# EAGLE design dlp.vco..v1.1.4.main (EAGLE 7.2.0)
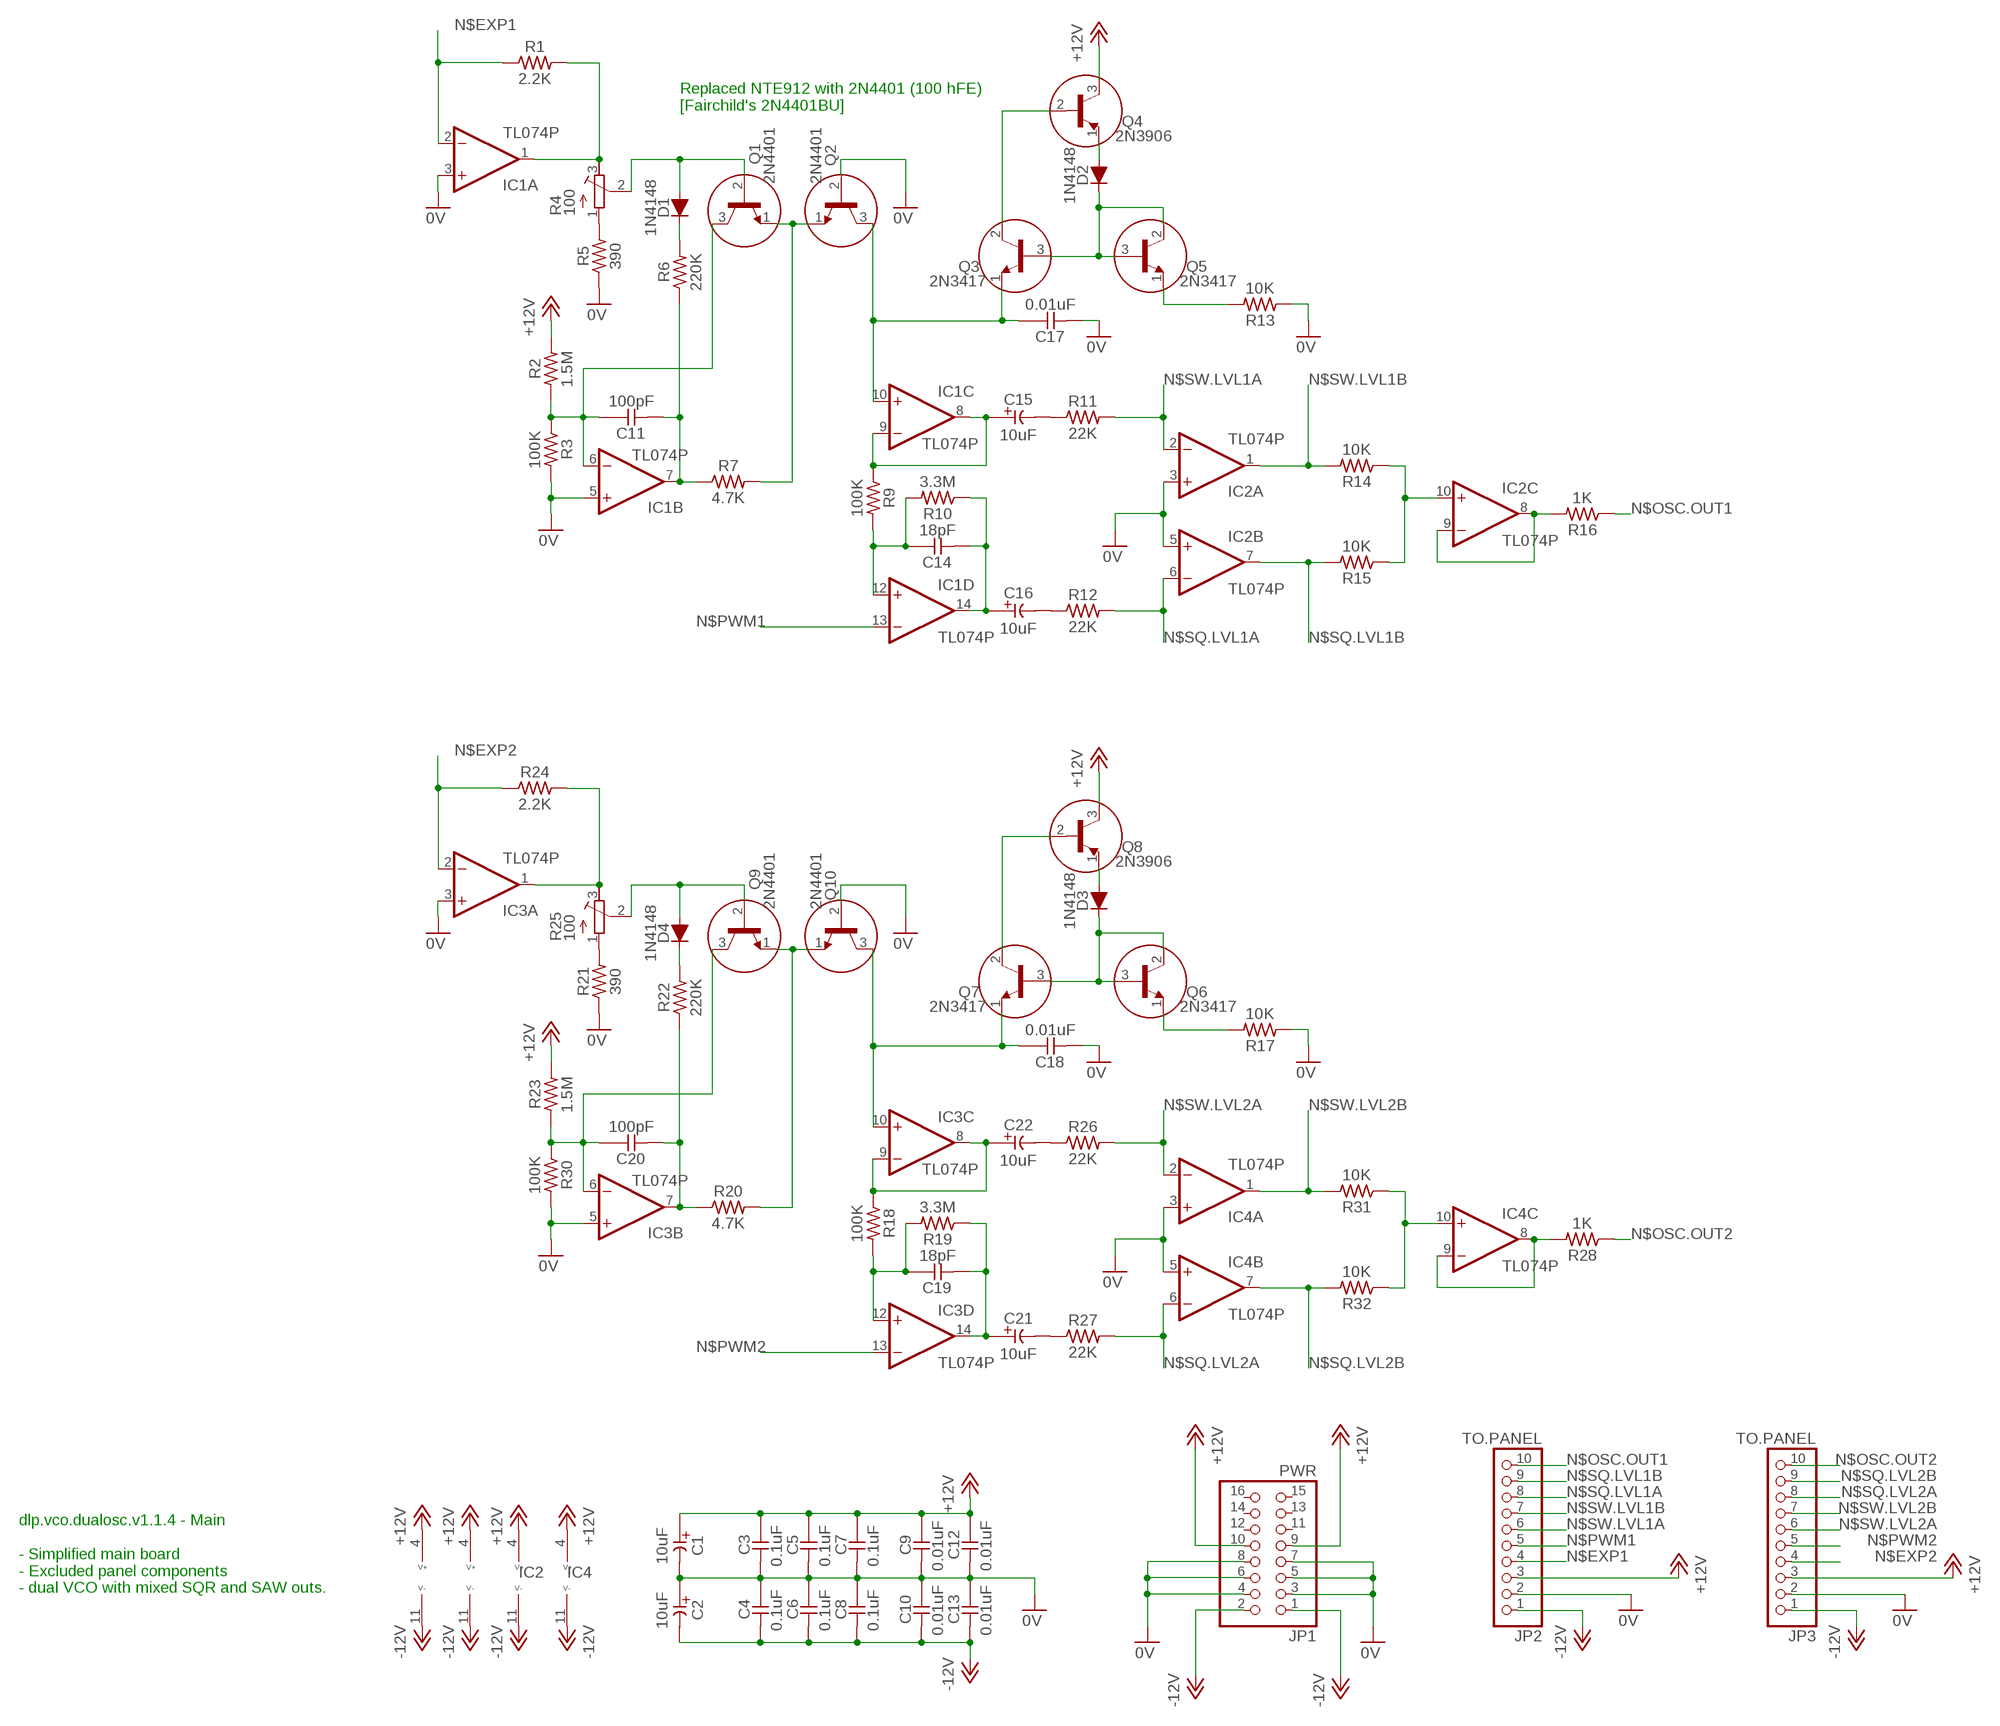
[diagram p0: schematic, sheet 1]

## Parts
C1  10uF  CE-USE2-5  [E2-5]
C2  10uF  CE-USE2-5  [E2-5]
C3  0.1uF  CC-US025-024X044  [C025-024X044]
C4  0.1uF  CC-US025-024X044  [C025-024X044]
C5  0.1uF  CC-US025-024X044  [C025-024X044]
C6  0.1uF  CC-US025-024X044  [C025-024X044]
C7  0.1uF  CC-US025-024X044  [C025-024X044]
C8  0.1uF  CC-US025-024X044  [C025-024X044]
C9  0.01uF  CC-US025-024X044  [C025-024X044]
C10  0.01uF  CC-US025-024X044  [C025-024X044]
C11  100pF  CC-US025-024X044  [C025-024X044]
C12  0.01uF  CC-US025-024X044  [C025-024X044]
C13  0.01uF  CC-US025-024X044  [C025-024X044]
C14  18pF  CC-US025-024X044  [C025-024X044]
C15  10uF  CE-USE2-5  [E2-5]
C16  10uF  CE-USE2-5  [E2-5]
C17  0.01uF  CC-US025-024X044  [C025-024X044]
C18  0.01uF  CC-US025-024X044  [C025-024X044]
C19  18pF  CC-US025-024X044  [C025-024X044]
C20  100pF  CC-US025-024X044  [C025-024X044]
C21  10uF  CE-USE2-5  [E2-5]
C22  10uF  CE-USE2-5  [E2-5]
D1  1N4148  [DO35-7]
D2  1N4148  [DO35-7]
D3  1N4148  [DO35-7]
D4  1N4148  [DO35-7]
IC1  TL074P  [DIL14]
IC2  TL074P  [DIL14]
IC3  TL074P  [DIL14]
IC4  TL074P  [DIL14]
JP1  PWR  PINHD-2X8  [2X08]
JP2  TO.PANEL  PINHD-1X10  [1X10]
JP3  TO.PANEL  PINHD-1X10  [1X10]
Q1  2N4401  [TO92]
Q2  2N4401  [TO92]
Q3  2N3417  [TO92]
Q4  2N3906  [TO92]
Q5  2N3417  [TO92]
Q6  2N3417  [TO92]
Q7  2N3417  [TO92]
Q8  2N3906  [TO92]
Q9  2N4401  [TO92]
Q10  2N4401  [TO92]
R1  2.2K  R0309/10  [0309/10]
R2  1.5M  R0309/10  [0309/10]
R3  100K  R0309/10  [0309/10]
R4  100  R-TRIMM3296Y  [RTRIM3296Y]
R5  390  R0309/10  [0309/10]
R6  220K  R0309/10  [0309/10]
R7  4.7K  R0309/10  [0309/10]
R9  100K  R0309/10  [0309/10]
R10  3.3M  R0309/10  [0309/10]
R11  22K  R0309/10  [0309/10]
R12  22K  R0309/10  [0309/10]
R13  10K  R0309/10  [0309/10]
R14  10K  R0309/10  [0309/10]
R15  10K  R0309/10  [0309/10]
R16  1K  R0309/10  [0309/10]
R17  10K  R0309/10  [0309/10]
R18  100K  R0309/10  [0309/10]
R19  3.3M  R0309/10  [0309/10]
R20  4.7K  R0309/10  [0309/10]
R21  390  R0309/10  [0309/10]
R22  220K  R0309/10  [0309/10]
R23  1.5M  R0309/10  [0309/10]
R24  2.2K  R0309/10  [0309/10]
R25  100  R-TRIMM3296Y  [RTRIM3296Y]
R26  22K  R0309/10  [0309/10]
R27  22K  R0309/10  [0309/10]
R28  1K  R0309/10  [0309/10]
R30  100K  R0309/10  [0309/10]
R31  10K  R0309/10  [0309/10]
R32  10K  R0309/10  [0309/10]

## Nets
0V: C1.- C2.+ C3.2 C4.1 C5.2 C6.1 C7.2 C8.1 C9.2 C10.1 C12.2 C13.1 C17.2 C18.2 IC1.3(A:+IN) IC1.5(B:+IN) IC2.3(A:+IN) IC2.5(B:+IN) IC3.3(A:+IN) IC3.5(B:+IN) IC4.3(A:+IN) IC4.5(B:+IN) JP1.3 JP1.4 JP1.5 JP1.6 JP1.7 JP1.8 JP2.2 JP3.2 Q2.2(B) Q10.2(B) R3.2 R5.1 R13.1 R17.1 R21.1 R30.2
+12V: C1.+ C3.1 C5.1 C7.1 C9.1 C12.1 IC1.4(P:V+) IC2.4(P:V+) IC3.4(P:V+) IC4.4(P:V+) JP1.9 JP1.10 JP2.3 JP3.3 Q4.3(C) Q8.3(C) R2.2 R23.2
-12V: C2.- C4.2 C6.2 C8.2 C10.2 C13.2 IC1.11(P:V-) IC2.11(P:V-) IC3.11(P:V-) IC4.11(P:V-) JP1.1 JP1.2 JP2.1 JP3.1
N$1: C17.1 IC1.10(C:+IN) Q2.3(C) Q3.1(E)
N$2: Q3.2(C) Q4.2(B)
N$3: D2.A Q4.1(E)
N$4: C15.+ IC1.8(C:OUT) IC1.9(C:-IN) R9.1
N$5: D2.C Q3.3(B) Q5.2(C) Q5.3(B)
N$6: Q5.1(E) R13.2
N$7: C14.1 IC1.12(D:+IN) R9.2 R10.2
N$9: C14.2 C16.+ IC1.14(D:OUT) R10.1
N$10: D1.A Q1.2(B) R4.2(S)
N$11: C18.1 IC3.10(C:+IN) Q7.1(E) Q10.3(C)
N$12: Q1.1(E) Q2.1(E) R7.2
N$13: D1.C R6.2
N$14: R4.1(A) R5.2
N$15: C11.1 IC1.6(B:-IN) Q1.3(C) R2.1 R3.1
N$16: IC1.1(A:OUT) R1.2 R4.3(E)
N$17: D3.A Q8.1(E)
N$18: IC2.10(C:+IN) R14.1 R15.1
N$19: Q6.1(E) R17.2
N$20: IC2.8(C:OUT) IC2.9(C:-IN) R16.2
N$21: D3.C Q6.2(C) Q6.3(B) Q7.3(B)
N$22: Q7.2(C) Q8.2(B)
N$23: C22.+ IC3.8(C:OUT) IC3.9(C:-IN) R18.1
N$24: C19.1 IC3.12(D:+IN) R18.2 R19.2
N$25: C19.2 C21.+ IC3.14(D:OUT) R19.1
N$26: Q9.1(E) Q10.1(E) R20.2
N$28: D4.C R22.2
N$29: C15.- R11.1
N$30: C16.- R12.1
N$31: C20.1 IC3.6(B:-IN) Q9.3(C) R23.1 R30.1
N$32: IC3.1(A:OUT) R24.2 R25.3(E)
N$33: C22.- R26.1
N$34: C21.- R27.1
N$35: IC4.10(C:+IN) R31.1 R32.1
N$36: IC4.8(C:OUT) IC4.9(C:-IN) R28.2
N$37: C11.2 IC1.7(B:OUT) R6.1 R7.1
N$40: R21.2 R25.1(A)
N$41: C20.2 IC3.7(B:OUT) R20.1 R22.1
N$42: D4.A Q9.2(B) R25.2(S)
N$EXP1: IC1.2(A:-IN) JP2.4 R1.1
N$EXP2: IC3.2(A:-IN) JP3.4 R24.1
N$OSC.OUT1: JP2.10 R16.1
N$OSC.OUT2: JP3.10 R28.1
N$PWM1: JP2.5
N$PWM2: JP3.5
N$SQ.LVL1A: IC2.6(B:-IN) JP2.8 R12.2
N$SQ.LVL1B: IC2.7(B:OUT) JP2.9 R15.2
N$SQ.LVL2A: IC4.6(B:-IN) JP3.8 R27.2
N$SQ.LVL2B: IC4.7(B:OUT) JP3.9 R32.2
N$SW.LVL1A: IC2.2(A:-IN) JP2.6 R11.2
N$SW.LVL1B: IC2.1(A:OUT) JP2.7 R14.2
N$SW.LVL2A: IC4.2(A:-IN) JP3.6 R26.2
N$SW.LVL2B: IC4.1(A:OUT) JP3.7 R31.2
Unconnected: IC1.13(D:-IN) IC2.12(D:+IN) IC2.13(D:-IN) IC2.14(D:OUT) IC3.13(D:-IN) IC4.12(D:+IN) IC4.13(D:-IN) IC4.14(D:OUT) JP1.11 JP1.12 JP1.13 JP1.14 JP1.15 JP1.16

## Notes on the sheet
- Replaced NTE912 with 2N4401 (100 hFE)
  [Fairchild's 2N4401BU]
- IC2 | IC4
- dlp.vco.dualosc.v1.1.4 - Main
  
  - Simplified main board 
  - Excluded panel components
  - dual VCO with mixed SQR and SAW outs.

## Library data of the parts
C1 C2 C15 C16 C21 C22 = _common:CE-US: ELECTROLYTIC CAPACITOR, US symbol
C3-C14 C17-C20 = _common:CC-US: CAPACITOR, US symbol
D1-D4 = _common:1N4148: DIODE high speed (Philips)
IC1-IC4 = _common:TL074: OP AMP
JP1 = pinhead:PINHD-2X8: PIN HEADER
JP2 JP3 = pinhead:PINHD-1X10: PIN HEADER
Q1 Q2 Q9 Q10 = _common:2N4401
Q3 Q5-Q7 = _common:2N3417: NPN Transistor
Q4 Q8 = _common:2N3906: PNP Transistor
R1-R3 R5-R7 R9-R24 R26-R28 R30-R32 = _common:R: RESISTOR, US symbol
R4 R25 = rcl:R-TRIMM: Trimm resistor

## Board
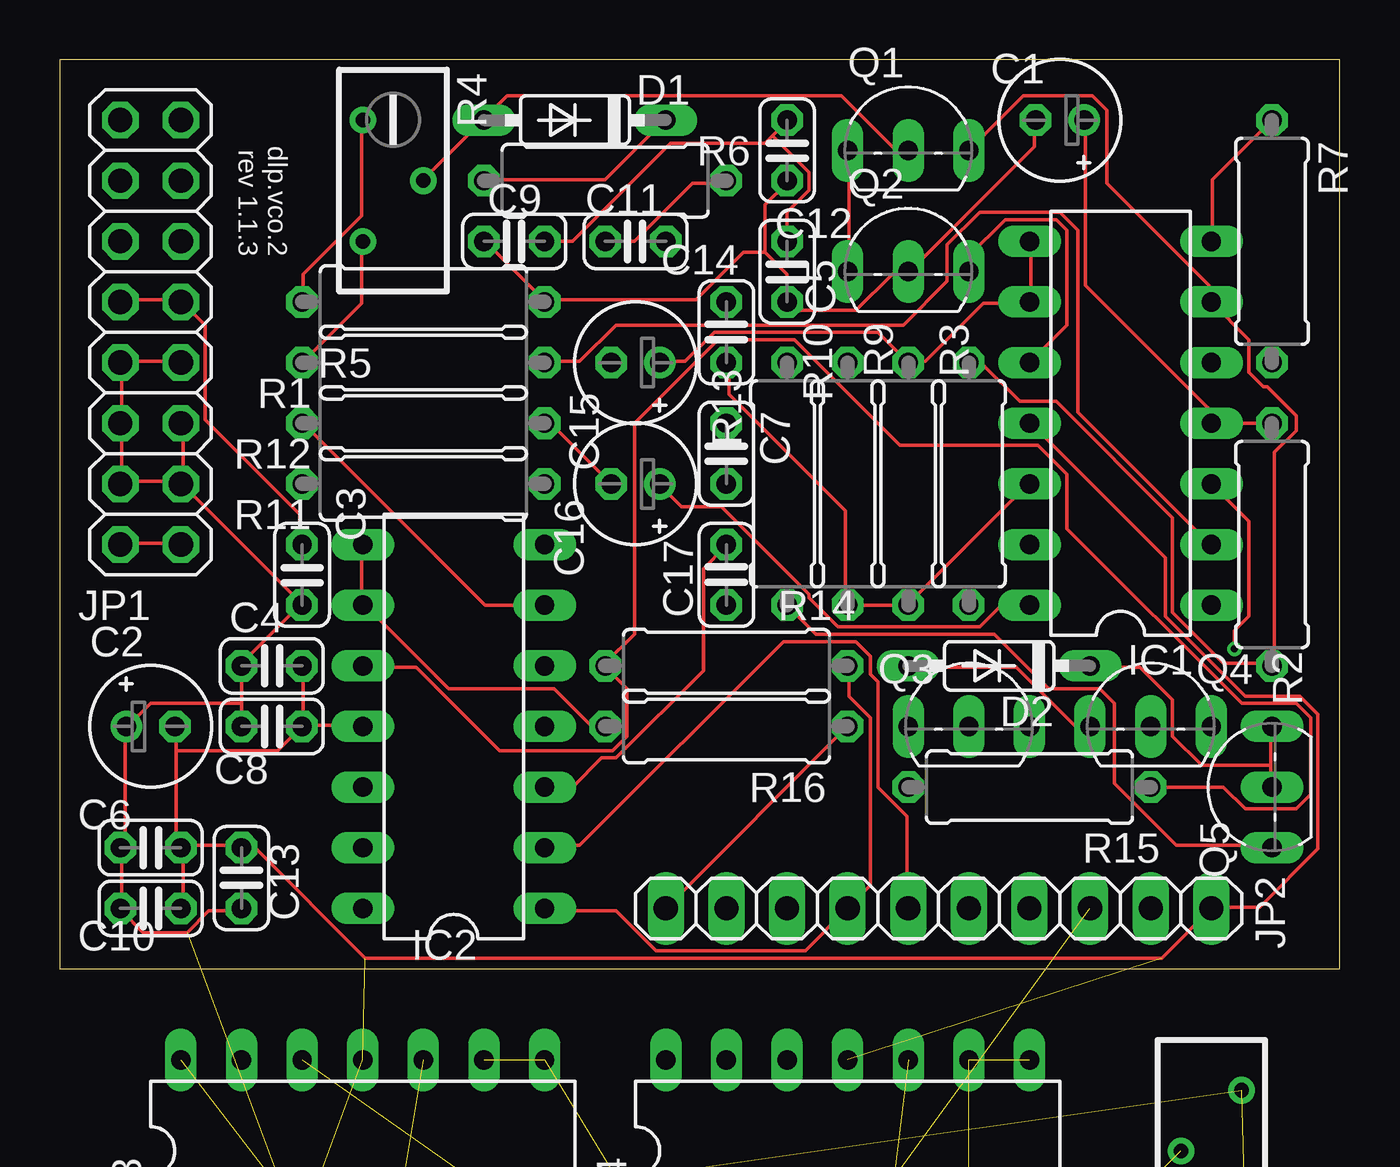
[diagram p1: board, top side]
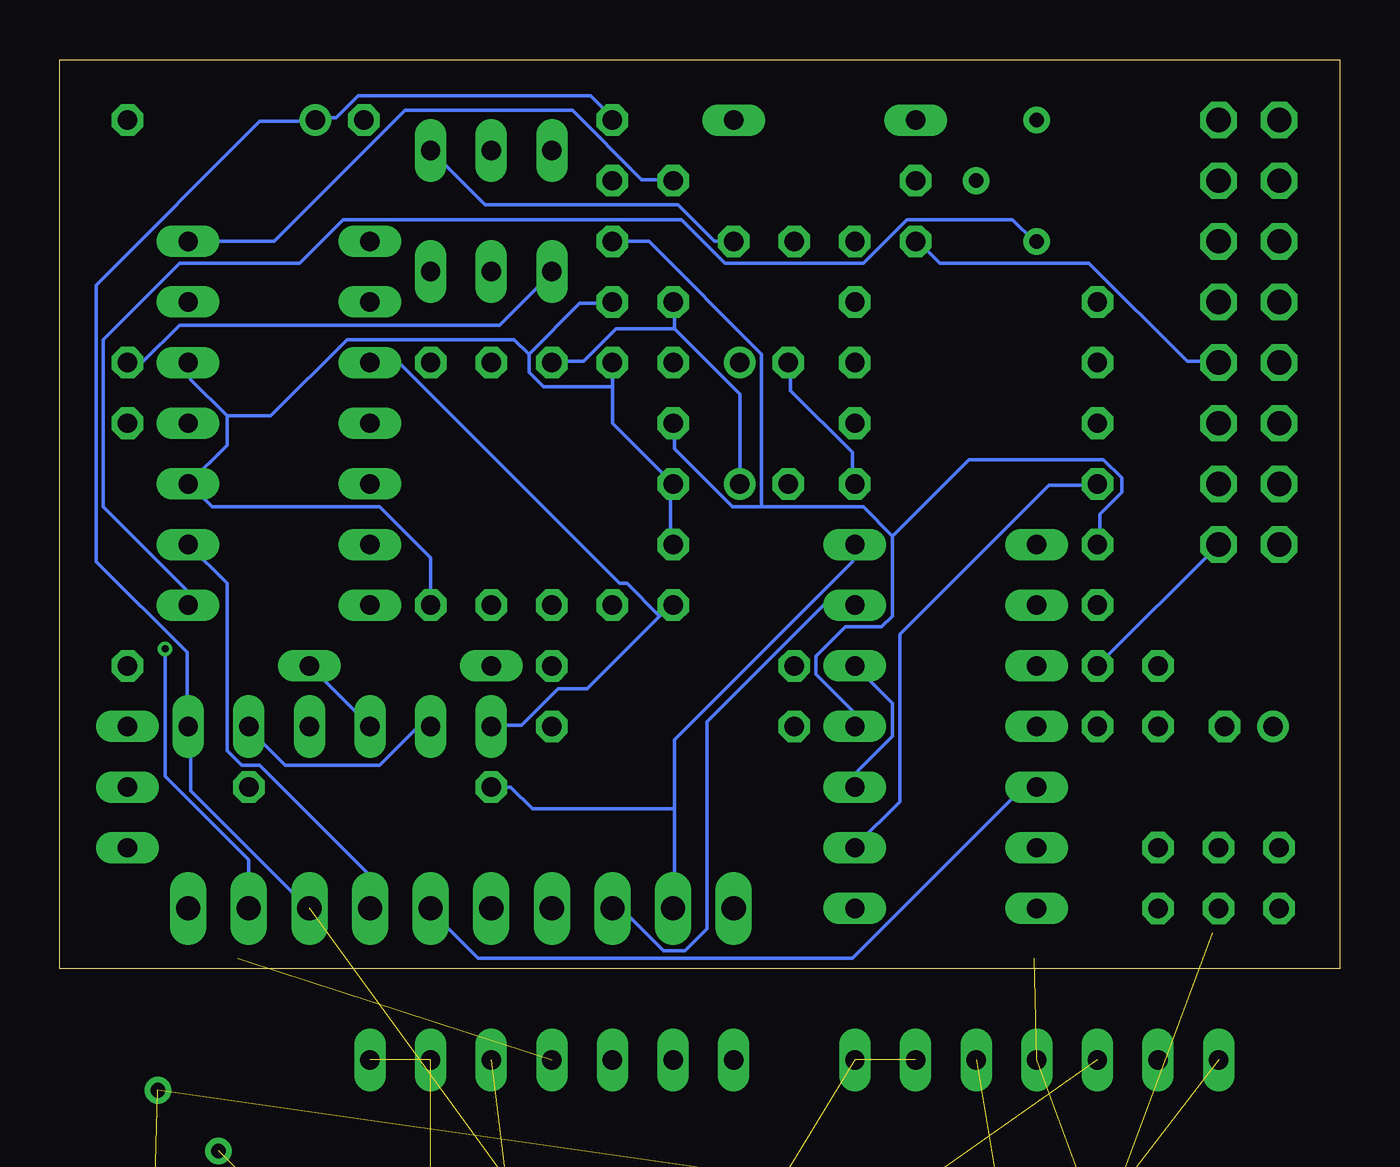
[diagram p2: board, bottom side, seen from below]

Size 53.65 x 38.09 mm. Coordinates in mm from the lower left corner, seen from the top.
Outline: 0,0 53.65,0 53.65,38.09 0,38.09 0,0
Copper layers (1*16): Top 0.035mm / dielectric 1.5mm / Bottom 0.035mm
Design rules "SeeedStudio_2layer_DRU_no_angle_20140221": minimum track width 6mil, minimum drill 12mil, track to track 6mil, track to pad 6mil, pad to pad 6mil, via to via 6mil, smd to smd 0mil, copper to edge 10mil, drill to drill 10mil, minimum pad ring 10mil, minimum via ring 6mil, stop-mask expansion 2mil, vias tented up to drill 100mil, thermal gap 10mil

### Footprints (pad centres in the part's own frame; a part is rotated, then mirrored left to right if it is on the bottom)
E2-5 = drill 0.813 pad 1.27: + -1.016,0 | drill 0.813 pad 1.27 octagon: - 1.016,0
C025-024X044 = drill 0.813 octagon: 1 -1.27,0; 2 1.27,0
DO35-7 = drill 0.813 long: A 3.81,0; C -3.81,0
DIL14 = drill 0.813 long: 1 -7.62,-3.81; 2 -5.08,-3.81; 3 -2.54,-3.81; 4 0,-3.81; 5 2.54,-3.81; 6 5.08,-3.81; 7 7.62,-3.81; 8 7.62,3.81; 9 5.08,3.81; 10 2.54,3.81; 11 0,3.81; 12 -2.54,3.81; 13 -5.08,3.81; 14 -7.62,3.81
2X08 = drill 1.016 octagon: 1 -8.89,-1.27; 2 -8.89,1.27; 3 -6.35,-1.27; 4 -6.35,1.27; 5 -3.81,-1.27; 6 -3.81,1.27; 7 -1.27,-1.27; 8 -1.27,1.27; 9 1.27,-1.27; 10 1.27,1.27; 11 3.81,-1.27; 12 3.81,1.27; 13 6.35,-1.27; 14 6.35,1.27; 15 8.89,-1.27; 16 8.89,1.27
1X10 = drill 1.016 long: 1 -11.43,0; 2 -8.89,0; 3 -6.35,0; 4 -3.81,0; 5 -1.27,0; 6 1.27,0; 7 3.81,0; 8 6.35,0; 9 8.89,0; 10 11.43,0
TO92 = drill 0.813 long: 1 -2.54,-1.27; 2 0,-1.27; 3 2.54,-1.27
0309/10 = drill 0.813 octagon: 1 -5.08,0; 2 5.08,0
RTRIM3296Y = drill 0.61: 1 1.27,-2.54; 2 -1.27,0; 3 1.27,2.54

### Placement (x,y rotation side)
C1  41.91,35.56 180 top
C2  3.81,10.16 0 top
C3  10.16,16.51 270 top
C4  8.89,12.7 0 top
C5  30.48,29.21 270 top
C6  3.81,5.08 0 top
C7  27.94,21.59 270 top
C8  8.89,10.16 0 top
C9  19.05,30.48 180 top
C10  3.81,2.54 0 top
C11  24.13,30.48 180 top
C12  30.48,34.29 270 top
C13  7.62,3.81 90 top
C14  27.94,26.67 90 top
C15  24.13,25.4 180 top
C16  24.13,20.32 180 top
C17  27.94,16.51 90 top
C18  30.48,-27.94 0 top  (outside the outline)
C19  45.72,-27.94 0 top  (outside the outline)
C20  38.1,-27.94 0 top  (outside the outline)
C21  30.48,-35.56 0 top  (outside the outline)
C22  40.64,-35.56 0 top  (outside the outline)
D1  21.59,35.56 180 top
D2  39.37,12.7 180 top
D3  7.62,-35.56 0 top  (outside the outline)
D4  20.32,-35.56 0 top  (outside the outline)
IC1  44.45,22.86 90 top
IC2  16.51,10.16 90 top
IC3  12.7,-7.62 0 top  (outside the outline)
IC4  33.02,-7.62 0 top  (outside the outline)
JP1  3.81,26.67 90 top
JP2  36.83,2.54 180 top
JP3  15.24,-27.94 0 top  (outside the outline)
Q1  35.56,35.56 0 top
Q2  35.56,30.48 0 top
Q3  38.1,11.43 0 top
Q4  45.72,11.43 0 top
Q5  49.53,7.62 90 top
Q6  5.08,-17.78 0 top  (outside the outline)
Q7  15.24,-17.78 0 top  (outside the outline)
Q8  25.4,-17.78 0 top  (outside the outline)
Q9  35.56,-17.78 0 top  (outside the outline)
Q10  45.72,-17.78 0 top  (outside the outline)
R1  15.24,25.4 180 top
R2  50.8,17.78 90 top
R3  38.1,20.32 270 top
R4  13.97,33.02 180 top
R5  15.24,27.94 180 top
R6  22.86,33.02 180 top
R7  50.8,30.48 270 top
R9  35.56,20.32 270 top
R10  33.02,20.32 270 top
R11  15.24,20.32 180 top
R12  15.24,22.86 180 top
R13  30.48,20.32 270 top
R14  27.94,12.7 0 top
R15  40.64,7.62 180 top
R16  27.94,10.16 180 top
R17  7.62,-43.18 0 top  (outside the outline)
R18  20.32,-43.18 0 top  (outside the outline)
R19  33.02,-43.18 0 top  (outside the outline)
R20  45.72,-43.18 0 top  (outside the outline)
R21  7.62,-50.8 0 top  (outside the outline)
R22  20.32,-50.8 0 top  (outside the outline)
R23  33.02,-50.8 0 top  (outside the outline)
R24  45.72,-50.8 0 top  (outside the outline)
R25  48.26,-7.62 0 top  (outside the outline)
R26  7.62,-58.42 0 top  (outside the outline)
R27  20.32,-58.42 0 top  (outside the outline)
R28  33.02,-58.42 0 top  (outside the outline)
R30  7.62,-66.04 0 top  (outside the outline)
R31  20.32,-66.04 0 top  (outside the outline)
R32  33.02,-66.04 0 top  (outside the outline)

### Tracks (layer width: path | path; a pad name or v marks a point on that pad's centre or on a via)
0V  (via drill 0.3)  (10 unrouted)
  Top 0.152: v49.23,13.41 49.23,14.17 49.84,14.78 49.84,18.75 IC1.3 | JP1.7 5.03,25.45 2.59,25.45 JP1.8 2.59,25.3 2.59,22.86 | 2.59,22.86 2.59,20.42 | JP1.3 5.18,20.42 5.18,22.86 JP1.5 | 2.59,20.42 5.03,20.42 JP1.3 | 2.59,20.42 JP1.4 | 2.59,22.86 JP1.6 | 7.62,11.12 C4.1 7.62,12.8 10.06,15.24 C3.2 10.21,15.24 5.18,20.27 JP1.3 | 7.62,11.12 C8.1 | C13.1 7.62,2.44 6.25,2.44 5.33,1.52 3.5,1.52 2.59,2.44 C10.1 2.59,2.59 2.59,5.03 C6.1 2.59,5.18 2.74,5.33 2.74,10.06 C2.+ 2.9,10.21 3.81,11.12 7.62,11.12 | IC2.3 21.49,7.62 22.71,8.84 23.32,8.84 26.98,12.5 26.98,16.76 27.89,17.68 C17.2 | C9.2 17.83,30.48 20.27,28.04 R5.1 20.42,28.04 26.67,28.04 28.65,30.02 29.57,30.02 | 29.57,30.02 30.48,29.11 C5.2 30.48,27.89 30.79,27.58 33.38,27.58 34.9,29.11 35.51,29.11 Q2.2 35.66,29.26 40.84,34.44 40.84,35.51 C1.- | 29.57,30.02 29.57,32 30.48,32.92 C12.2
  Bottom 0.152: R3.2 38.1,17.22 40.23,19.36 47.24,19.36 48.16,20.27 IC1.3 46.63,21.95 46.63,23.16 | 46.63,23.16 48.16,24.69 48.16,25.3 IC1.5 | JP2.2 45.72,4.57 49.23,8.08 v49.23,13.41 | IC2.5 18.75,11.12 18.75,9.75 20.27,8.23 20.27,7.62 IC2.3 | C17.2 28.04,17.83 28.04,20.27 C7.2 30.48,22.86 30.48,24.38 | 30.48,24.38 R13.1 | 30.48,24.38 33.38,24.38 33.98,24.99 33.98,25.76 | 33.98,25.76 31.85,27.89 30.48,27.89 C5.2 | JP1.7 5.18,25.45 6.4,25.45 10.52,29.57 16.76,29.57 17.68,30.48 C9.2 | 46.63,23.16 44.81,23.16 41.6,26.36 34.59,26.36 33.98,25.76
+12V  (5 unrouted)
  Top 0.152: C3.1 10.06,17.83 10.06,19.05 6.1,23.01 6.1,26.98 5.18,27.89 JP1.9 5.03,28.04 2.59,28.04 JP1.10 | R2.2 IC1.4 48.16,22.86 48.16,23.47 42.98,28.65 42.98,35.51 C1.+ | C9.1 21.49,30.48 25.6,34.59 29.57,34.59 29.87,34.9 | 29.87,34.9 30.48,35.51 C12.1 | C5.1 30.48,31.7 31.39,32.61 31.39,33.38 29.87,34.9
  Bottom 0.152: 18.75,18.14 18.75,14.78 19.2,14.33 20.73,14.33 21.95,13.11 21.95,12.34 20.42,10.82 20.42,10.21 IC2.4 | 18.75,18.14 19.96,19.36 24.23,19.36 | 24.23,19.36 25.45,19.36 27.89,21.79 27.89,22.86 C7.1 | 18.75,18.14 15.54,21.34 9.91,21.34 9.14,20.57 9.14,19.96 10.06,19.05 10.06,17.83 C3.1 | JP2.3 43.28,2.59 48.16,7.47 48.16,10.06 Q4.3 48.31,10.21 48.31,13.26 52.12,17.07 52.12,28.65 45.26,35.51 42.98,35.51 C1.+ 42.82,35.66 42.06,35.66 41.15,36.58 31.39,36.58 30.48,35.66 C12.1 | 24.23,19.36 24.23,25.76 28.96,30.48 C5.1
-12V  (3 unrouted)
  Top 0.152: C10.2 5.18,2.59 5.18,5.03 C6.2 | C6.2 5.18,5.18 7.62,5.18 C13.2 7.62,5.03 8.23,5.03 12.8,0.46 46.18,0.46 JP2.1 48.31,2.59 50.29,2.59 52.73,5.03 52.73,10.67 51.97,11.43 49.68,11.43 46.33,14.78 46.33,17.22 40.69,22.86 IC1.11 | 4.88,9.14 4.88,5.33 5.03,5.18 C6.2 | 4.88,9.14 4.88,10.06 C2.- | JP1.2 2.59,17.83 5.03,17.83 JP1.1 | 10.21,10.21 10.21,12.65 C4.2 | 10.21,10.21 12.65,10.21 IC2.11 | 10.21,10.21 C8.2 9.14,9.14 4.88,9.14
  Bottom 0.152: C4.2 JP1.1
N$1
  Top 0.152: Q2.3 38.1,29.87 39.62,31.39 41.76,31.39 42.22,30.94 42.22,26.98 IC1.10
  Bottom 0.152: 28.5,14.78 28.04,15.24 C17.1 | 28.5,14.78 31.55,11.73 32.77,11.73 34.29,10.21 35.51,10.21 Q3.1 | 28.5,14.78 29.87,16.15 30.18,16.15 39.32,25.3 40.54,25.3 IC1.10
N$2
  Bottom 0.152: Q3.2 38.1,10.06 38.71,10.06 40.23,8.53 44.2,8.53 45.72,10.06 Q4.2
N$3
  Top 0.152: Q4.1 43.13,10.21 42.52,10.21 40.08,12.65 35.66,12.65 D2.A
N$4
  Top 0.152: IC1.8 40.69,30.48 40.69,28.04 IC1.9 40.54,27.89 38.71,27.89 36.27,25.45 35.66,25.45 R9.1 34.29,26.67 27.43,26.67 26.21,25.45 25.15,25.45 C15.+
N$5
  Top 0.152: 50.75,8.53 50.75,10.06 Q5.3 | 50.75,8.53 50.75,7.62 Q5.2 | 50.75,8.53 47.85,8.53 46.63,9.75 46.63,11.28 45.26,12.65 43.28,12.65 D2.C
  Bottom 0.152: D2.C Q3.3
N$6
  Top 0.152: R13.2 31.7,14.02 39.17,14.02 41.45,11.73 43.59,11.73 44.2,11.12 44.2,7.77 46.79,5.18 50.75,5.18 Q5.1
N$7
  Top 0.152: C14.1 28.04,25.3 28.04,24.08 32.92,19.2 32.92,15.24 R10.2 35.51,15.24 | 35.51,15.24 40.54,20.27 IC1.12 | 35.51,15.24 R9.2
N$9
  Top 0.152: IC1.14 39.47,15.24 38.56,14.33 32.61,14.33 31.39,15.54 31.39,15.7 27.74,19.36 26.06,19.36 25.15,20.27 C16.+
  Bottom 0.152: C16.+ 25.15,24.08 27.89,26.82 | 27.89,26.82 27.89,27.89 C14.2 | 27.89,26.82 30.33,26.82 31.7,25.45 32.92,25.45 R10.1
N$10
  Top 0.152: R4.2 15.24,33.07 17.68,35.51 D1.A 17.83,35.66 18.75,36.58 32.77,36.58 35.05,34.29 Q1.2
N$11  (3 unrouted)
N$12
  Top 0.152: Q2.1 33.07,29.26 33.07,34.29 Q1.1
  Bottom 0.152: R7.2 50.75,25.45 50.14,25.45 48.62,26.98 35.2,26.98 33.07,29.11 Q2.1
N$13
  Top 0.152: R6.2 17.83,33.07 22.86,33.07 25.3,35.51 D1.C
N$14
  Top 0.152: R4.1 12.65,35.51 12.65,31.55 10.21,29.11 10.21,28.04 R5.2
N$15
  Top 0.152: R3.1 38.1,25.3 38.71,25.3 40.23,23.77 41.76,23.77 46.63,18.9 46.63,14.94 48.77,12.8 50.75,12.8 R2.1 50.9,12.8 50.9,21.64 51.82,22.55 51.82,23.16 50.6,24.38 50.44,24.38 49.84,24.99 49.84,26.36 IC1.6 48.16,28.04 48.16,28.65 43.89,32.92 43.89,35.97 43.28,36.58 40.39,36.58 Q1.3
  Bottom 0.152: C11.1 26.21,30.48 27.74,32 35.81,32 Q1.3
N$16
  Top 0.152: R1.2 12.65,27.89 12.65,30.48 R4.3
  Bottom 0.152: IC1.1 48.31,15.24 48.31,15.85 51.82,19.36 51.82,26.36 48.62,29.57 43.59,29.57 41.76,31.39 27.58,31.39 25.76,29.57 19.96,29.57 18.14,31.39 13.72,31.39 12.8,30.48 R4.3
N$17  (1 unrouted)
N$18
  Top 0.152: IC2.10 12.8,12.65 14.94,12.65 18.44,9.14 23.16,9.14 23.77,9.75 23.77,11.73 22.86,12.65 R14.1 22.86,12.8 24.08,14.02 24.08,22.86 27.58,26.36 30.79,26.36 35.2,21.95 41,21.95 42.22,20.73 42.22,18.44 49.53,11.12 51.82,11.12 52.43,10.52 52.43,7.32 51.82,6.71 49.68,6.71 48.77,7.62 R15.1
N$19  (1 unrouted)
N$20
  Top 0.152: IC2.8 12.65,17.68 12.65,15.24 IC2.9 12.8,15.24 16.31,11.73 20.73,11.73 22.25,10.21 22.86,10.21 R16.2
N$21  (3 unrouted)
N$22  (1 unrouted)
N$23  (3 unrouted)
N$24  (3 unrouted)
N$25  (3 unrouted)
N$26  (2 unrouted)
N$28  (1 unrouted)
N$29
  Bottom 0.152: R11.1 20.42,20.42 20.42,21.64 23.01,24.23 23.01,25.3 C15.-
N$30
  Top 0.152: C16.- 20.57,22.86 R12.1
N$31  (4 unrouted)
N$32  (2 unrouted)
N$33  (1 unrouted)
N$34  (1 unrouted)
N$35  (2 unrouted)
N$36  (2 unrouted)
N$37
  Top 0.152: C11.2 24.08,30.48 26.52,32.92 27.89,32.92 R6.1 | R7.1 48.31,33.07 48.31,30.48 IC1.7
  Bottom 0.152: IC1.7 44.65,30.48 39.17,35.97 32.16,35.97 29.26,33.07 28.04,33.07 R6.1
N$40  (1 unrouted)
N$41  (3 unrouted)
N$42  (2 unrouted)
N$EXP1
  Top 0.152: R1.1 20.42,25.45 21.79,25.45 23.32,26.98 35.36,26.98 37.19,28.8 37.19,30.33 38.56,31.7 41.91,31.7 42.67,30.94 42.67,23.32 48.16,17.83 IC1.2
  Bottom 0.152: IC1.2 46.63,16.15 46.63,9.14 46.02,8.53 45.26,8.53 40.69,3.96 40.69,2.59 JP2.4
N$EXP2  (2 unrouted)
N$OSC.OUT1
  Top 0.152: JP2.10 R16.1
N$OSC.OUT2  (1 unrouted)
N$PWM1
  Bottom 0.152: 13.26,7.62 20.42,0.46 36.12,0.46 38.1,2.44 JP2.5
N$SQ.LVL1A
  Top 0.152: IC2.6 17.83,15.24 10.21,22.86 R12.2
  Bottom 0.152: IC2.6 21.64,15.24 26.52,10.36 26.52,1.68 27.43,0.76 28.35,0.76 30.02,2.44 30.48,2.44 JP2.8
N$SQ.LVL1B
  Bottom 0.152: 27.89,6.71 27.89,2.59 JP2.9 | 27.89,6.71 27.89,9.6 20.42,17.07 20.42,17.68 IC2.7 | R15.2 34.75,7.62 33.83,6.71 27.89,6.71
N$SQ.LVL2A  (2 unrouted)
N$SQ.LVL2B  (2 unrouted)
N$SW.LVL1A
  Top 0.152: JP2.6 35.51,2.59 35.51,6.4 34.29,7.62 34.29,12.04 33.98,12.34 33.98,13.11 33.38,13.72 30.33,13.72 21.79,5.18 20.42,5.18 IC2.2
  Bottom 0.152: R11.2 10.21,20.27 12.19,20.27 18.44,14.02 18.44,7.01 20.27,5.18 IC2.2
N$SW.LVL1B
  Top 0.152: IC2.1 20.42,2.44 23.32,2.44 24.99,0.76 31.24,0.76 JP2.7 33.98,3.5 33.98,10.52 33.07,11.43 33.07,12.65 R14.2
N$SW.LVL2A  (2 unrouted)
N$SW.LVL2B  (2 unrouted)

### Text on the board
tNames: dlp.vco.2 / rev 1.1.3